# EAGLE design ESP-01_programmer (EAGLE 8.7.0)
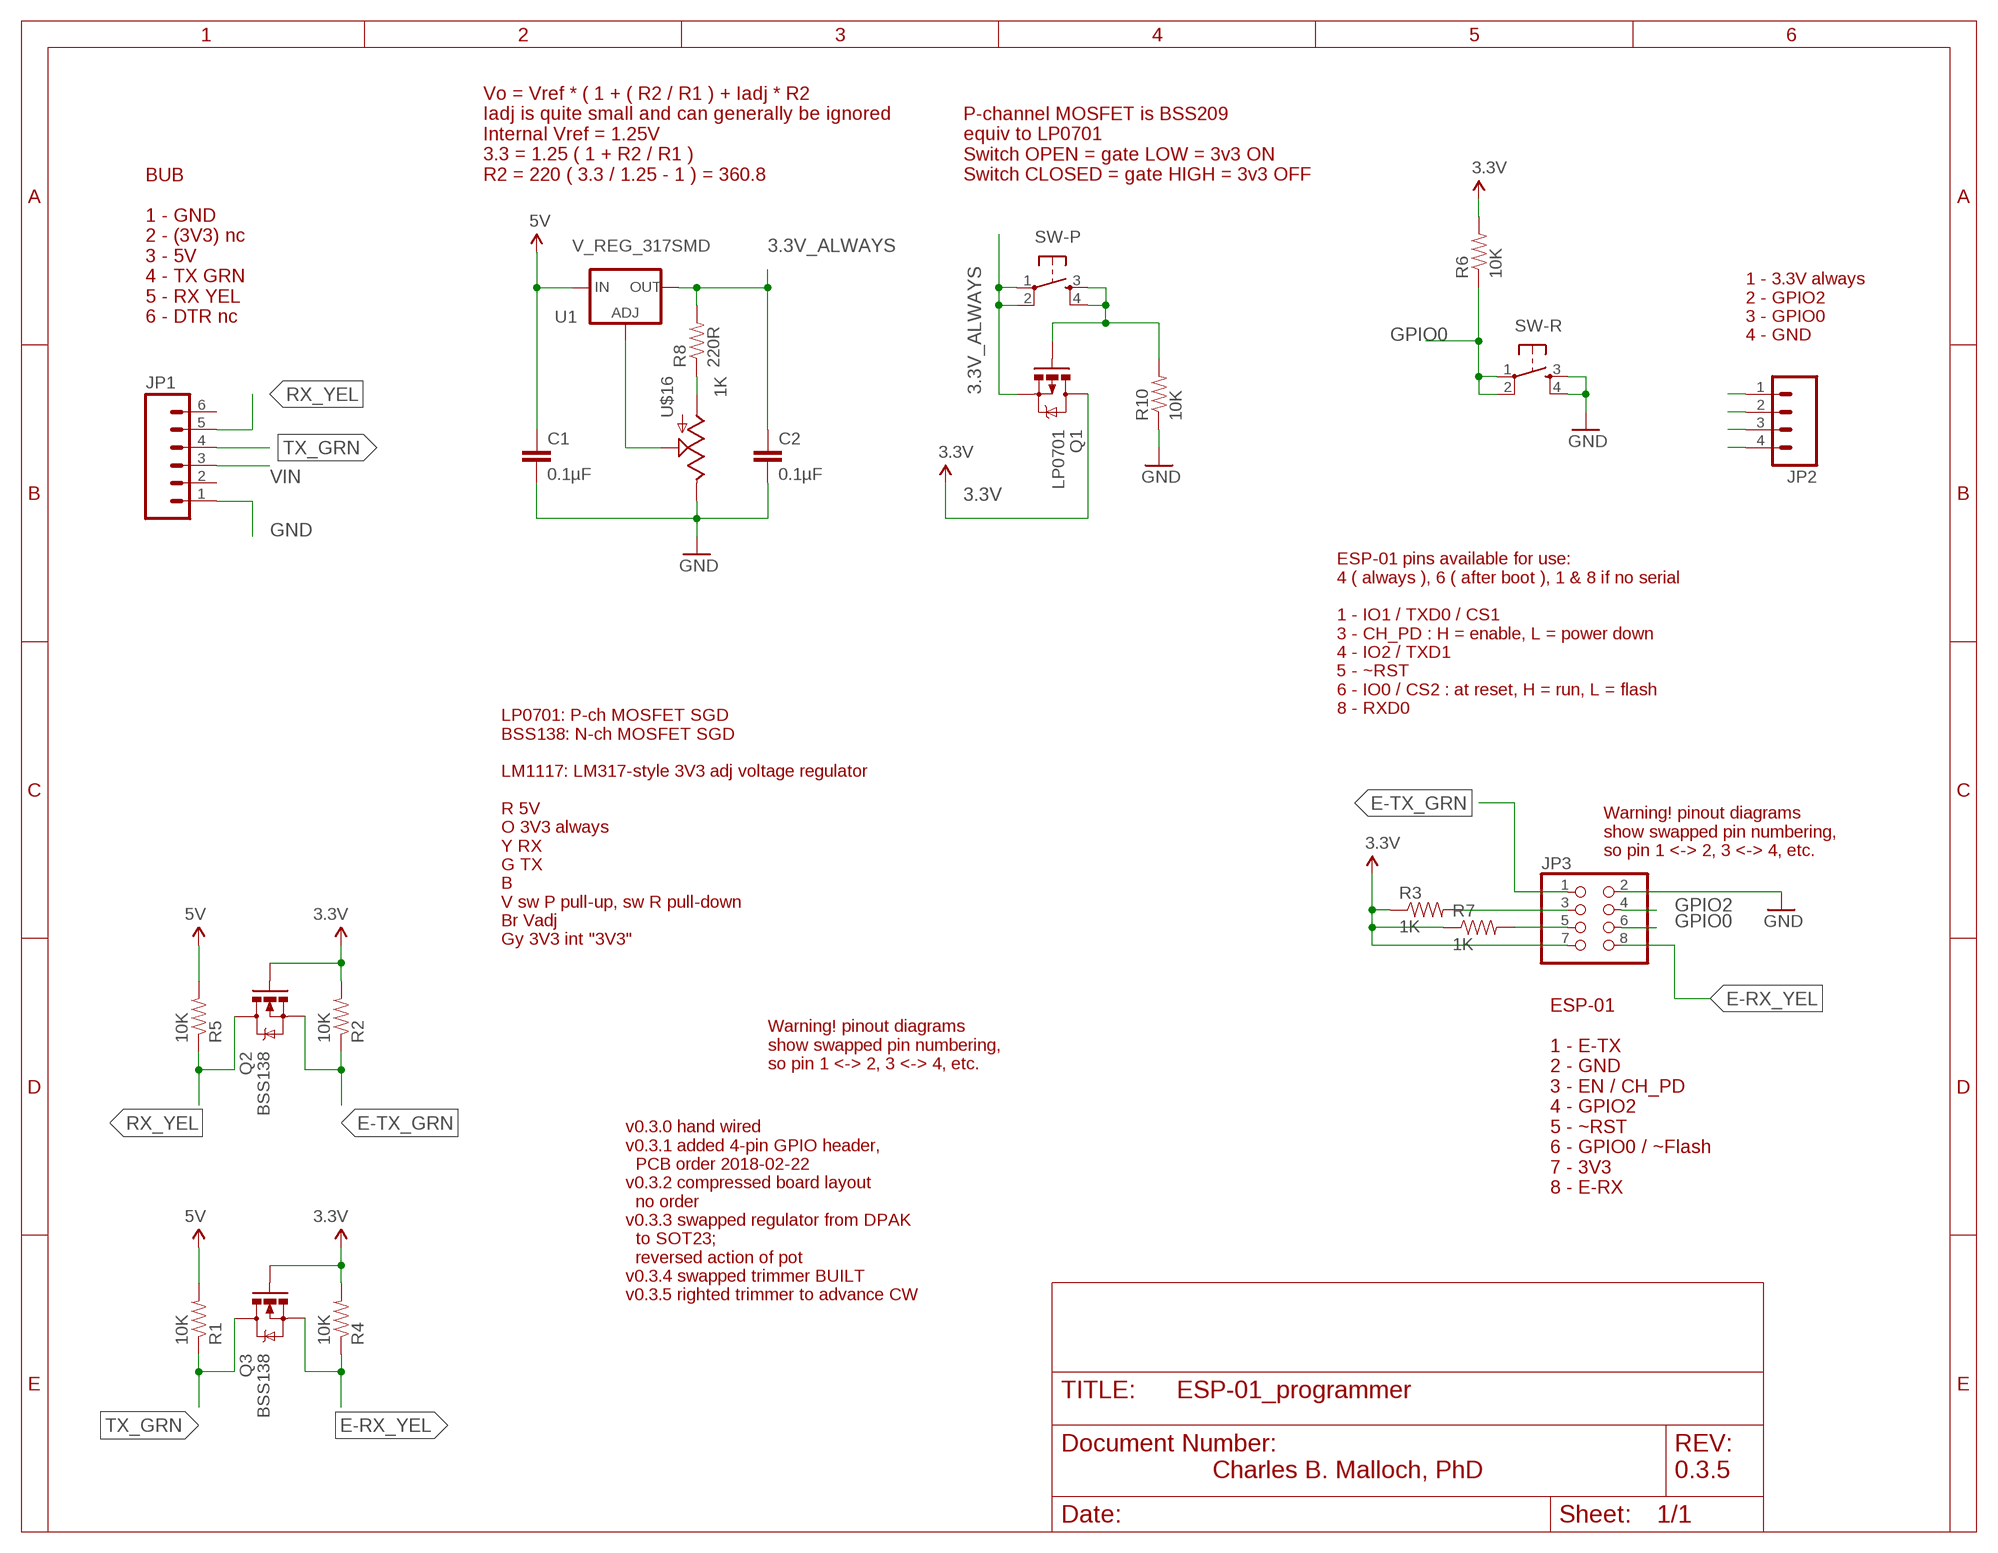
[diagram p0: schematic, sheet 1]

## Parts
C1  0.1µF  CAP1206  [1206]
C2  0.1µF  CAP1206  [1206]
JP1  M06LOCK_LONGPADS  [1X06_LOCK_LONGPADS]
JP2  M04LOCK_LONGPADS  [1X04_LOCK_LONGPADS]
JP3  PINHD-2X4  [2X04]
Q1  LP0701  MOSFET-PCHANNELSMD  [SOT23-3]
Q2  BSS138  BSS138TRANS-00830  [SOT23-3]
Q3  BSS138  BSS138TRANS-00830  [SOT23-3]
R1  10K  RESISTOR1206  [1206]
R2  10K  RESISTOR1206  [1206]
R3  1K  RESISTOR1206  [1206]
R4  10K  RESISTOR1206  [1206]
R5  10K  RESISTOR1206  [1206]
R6  10K  RESISTOR1206  [1206]
R7  1K  RESISTOR1206  [1206]
R8  220R  RESISTOR1206  [1206]
R10  10K  RESISTOR1206  [1206]
SW-P  TAC_SWITCHPTH  [TACTILE-PTH]
SW-R  TAC_SWITCHPTH  [TACTILE-PTH]
U1  V_REG_317SMD  [SOT223]
U$16  1K  POT100K_3362U  [3362U]

## Nets
3.3V: JP3.7 Q1.3(D) Q2.1(G) Q3.1(G) R2.2 R3.1 R4.2 R6.2 R7.1
3.3V_ALWAYS: C2.1 JP2.1 Q1.2(S) R8.2 SW-P.1 SW-P.2 U1.2(OUT)
E-RX_YEL: JP3.8 Q3.2(S) R4.1
E-TX_GRN: JP3.1 Q2.2(S) R2.1
GND: C1.2 C2.2 JP1.1 JP2.4 JP3.2 R10.1 SW-R.3 SW-R.4 U$16.P$1(E)
GPIO0: JP2.3 JP3.6 R6.1 SW-R.1 SW-R.2
GPIO2: JP2.2 JP3.4
N$1: JP3.3 R3.2
N$2: JP3.5 R7.2
N$3: R8.1 U$16.P$3(A)
N$5: U1.1(ADJ) U$16.P$2(S)
N$7: Q1.1(G) R10.2 SW-P.3 SW-P.4
RX_YEL: JP1.5 Q2.3(D) R5.1
TX_GRN: JP1.4 Q3.3(D) R1.1
VIN: C1.1 JP1.3 R1.2 R5.2 U1.3(IN) ; supply symbol labelled 5V
Unconnected: JP1.2 JP1.6

## Notes on the sheet
- Vo = Vref * ( 1 + ( R2 / R1 ) + Iadj * R2
  Iadj is quite small and can generally be ignored
  Internal Vref = 1.25V
  3.3 = 1.25 ( 1 + R2 / R1 )
  R2 = 220 ( 3.3 / 1.25 - 1 ) = 360.8
- P-channel MOSFET is BSS209
  equiv to LP0701
  Switch OPEN = gate LOW = 3v3 ON
  Switch CLOSED = gate HIGH = 3v3 OFF
- BUB
  
  1 - GND
  2 - (3V3) nc
  3 - 5V
  4 - TX GRN
  5 - RX YEL
  6 - DTR nc
- 1 - 3.3V always
  2 - GPIO2
  3 - GPIO0
  4 - GND
- ESP-01 pins available for use:
  4 ( always ), 6 ( after boot ), 1 & 8 if no serial
  
  1 - IO1 / TXD0 / CS1
  3 - CH_PD : H = enable, L = power down
  4 - IO2 / TXD1
  5 - ~RST
  6 - IO0 / CS2 : at reset, H = run, L = flash
  8 - RXD0
- Warning! pinout diagrams 
  show swapped pin numbering, 
  so pin 1 <-> 2, 3 <-> 4, etc.
- LP0701: P-ch MOSFET SGD
  BSS138: N-ch MOSFET SGD
  
  LM1117: LM317-style 3V3 adj voltage regulator
  
  R 5V
  O 3V3 always
  Y RX
  G TX
  B
  V sw P pull-up, sw R pull-down
  Br Vadj
  Gy 3V3 int "3V3"
- Warning! pinout diagrams 
  show swapped pin numbering, 
  so pin 1 <-> 2, 3 <-> 4, etc.
- ESP-01
  
  1 - E-TX
  2 - GND
  3 - EN / CH_PD
  4 - GPIO2
  5 - ~RST
  6 - GPIO0 / ~Flash
  7 - 3V3
  8 - E-RX
- v0.3.0 hand wired
  v0.3.1 added 4-pin GPIO header, 
    PCB order 2018-02-22
  v0.3.2 compressed board layout
    no order
  v0.3.3 swapped regulator from DPAK 
    to SOT23;
    reversed action of pot
  v0.3.4 swapped trimmer BUILT
  v0.3.5 righted trimmer to advance CW
- Charles B. Malloch, PhD | 0.3.5

## Library data of the parts
C1 C2 = SparkFun-Capacitors:CAP: Capacitor Standard 0603 ceramic capacitor, and 0.1" leaded capacitor.
JP1 = SparkFun-Connectors:M06: Header 6 Standard 6-pin 0.1" header. Use with straight break away headers (SKU : PRT-00116), right angle break away headers (PRT-00553), swiss pins (PRT-00743), machine pins (PRT-00117), and female headers (PRT-00115). Molex polarized connector foot print use with SKU : PRT-08094 with associated crimp pins and housings. NOTES ON THE VARIANTS LOCK and LOCK_LONGPADS... This footprint was designed to help hold the alignment of a through-hole component (i.e. 6-pin header) while soldering it into place. You may notice that each hole has been shifted either up or down by 0.005 of an inch from it's more standard position (which is a perfectly straight line). This slight alteration caused the pins (the squares in the middle) to touch the edges of the holes. Because they are alternating, it causes a "brace" to hold the component in place. 0.005 has proven to be the perfect amount of "off-center" position when using our standard breakaway headers. Although looks a little odd when you look at the bare footprint, once you have a header in there, the alteration is very hard to notice. Also, if you push a header all the way into place, it is covered up entirely on the bottom side. This idea of altering the position of holes to aid alignment will be further integrated into the Sparkfun Library for other footprints. It can help hold any component with 3 or more connection pins.
JP2 = SparkFun-Connectors:M04: Header 4 Standard 4-pin 0.1" header. Use with straight break away headers (SKU : PRT-00116), right angle break away headers (PRT-00553), swiss pins (PRT-00743), machine pins (PRT-00117), and female headers (PRT-00115). Molex polarized connector foot print use with SKU : PRT-08231 with associated crimp pins and housings. 1MM SMD Version SKU: PRT-10208
JP3 = pinhead:PINHD-2X4: PIN HEADER
Q1 = SparkFun-DiscreteSemi:MOSFET-PCHANNEL: Generic PMOSFET
Q2 Q3 = SparkFun-DiscreteSemi:BSS138: NMOSFET, Enh Mode 50V/6-ohm 200mA (SOT-23) TRANS-00830; PROD_ID: TRANS-00830
R1-R8 R10 = SparkFun-Passives:RESISTOR: Resistor Basic schematic elements and footprints for 0603, 1206, and PTH resistors.
SW-P SW-R = SparkFun-Electromechanical:TAC_SWITCH: Momentary Switch Button commonly used for reset or general input. Spark Fun Electronics SKU : COM-00097 SMT- SWCH-08247
U1 = SparkFun-PowerIC:V_REG_317: Voltage Regulator Standard LM317 adjustable voltage regulator. AOI (Adjust Output Input). Google 'LM317 Calculator' for easy to use app to get the two resistor values needed. 240/720 for 5V output. 240/390 for 3.3V output. Spark Fun Electronics SKU : COM-00527
U$16 = SparkFun-Electromechanical:POT

## Net classes
0 default: width 0.406 mm, clearance 0.254 mm
1 POWER: width 0.61 mm, clearance 0.305 mm

## Board
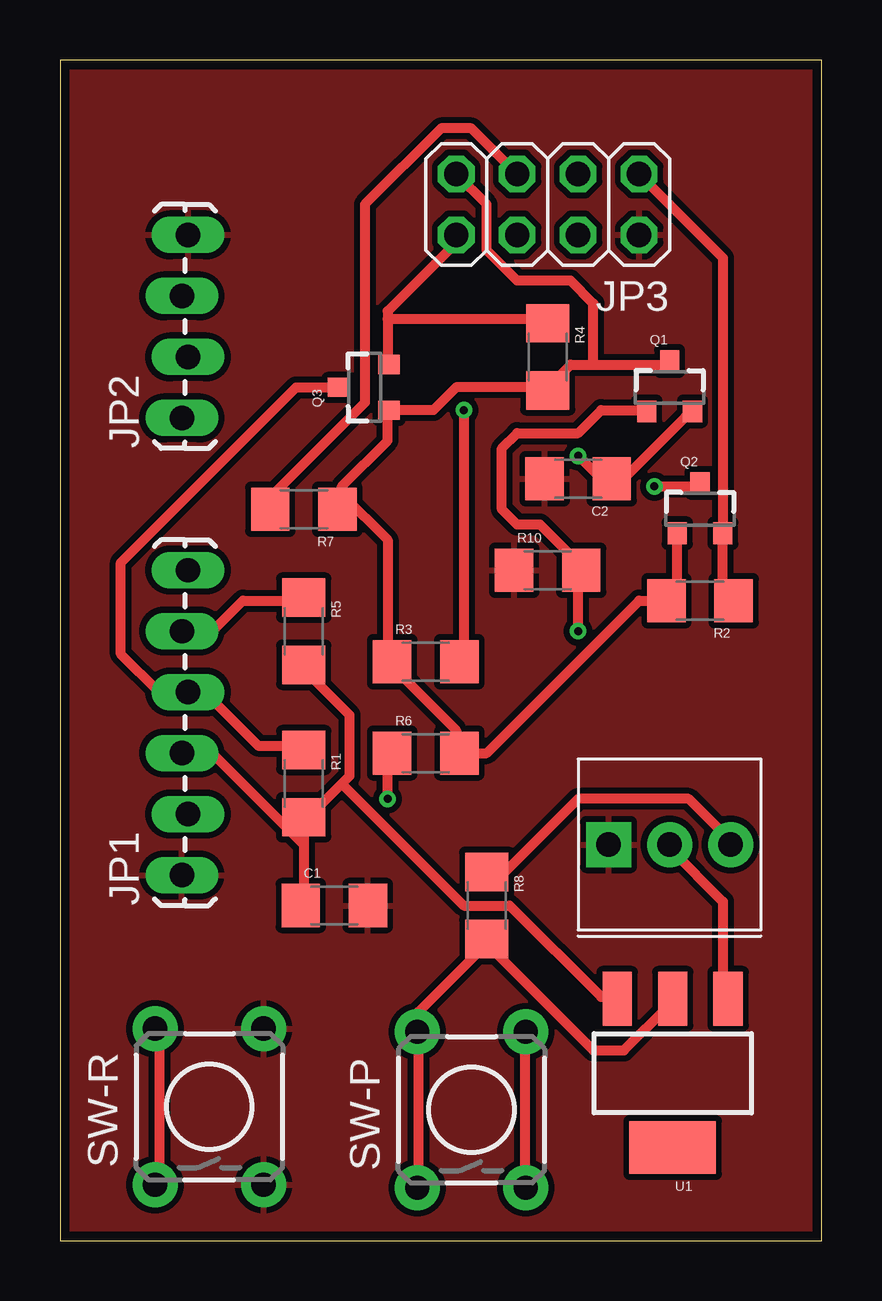
[diagram p1: board, top side]
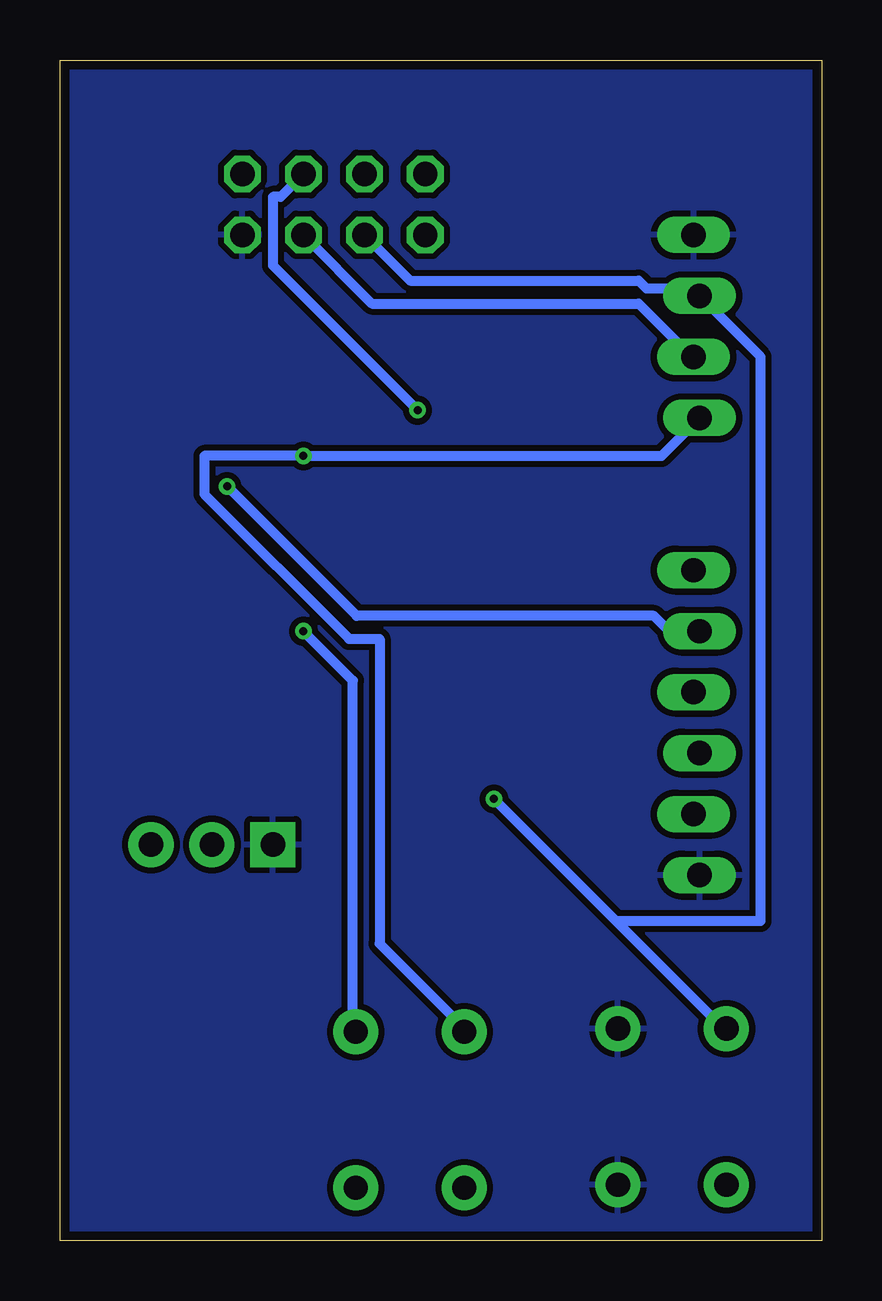
[diagram p2: board, bottom side, seen from below]

Size 31.73 x 49.2 mm. Coordinates in mm from the lower left corner, seen from the top.
Outline: 0,0 31.73,0 31.73,49.2 0,49.2 0,0
Copper layers (1*16): Top 0.0356mm / dielectric 1.5011mm / Bottom 0.0356mm
Design rules "LaenPCBOrder": minimum track width 6mil, minimum drill 13mil, track to track 6mil, track to pad 6mil, pad to pad 6mil, via to via 6mil, smd to smd 6mil, copper to edge 15mil, drill to drill 6mil, minimum pad ring 7mil, minimum via ring 7mil, stop-mask expansion 4mil, vias tented up to drill 0mil, thermal gap 10mil

### Footprints (pad centres in the part's own frame; a part is rotated, then mirrored left to right if it is on the bottom)
1206 = smd 1.6 x 1.8: 1 -1.4,0; 2 1.4,0
1X06_LOCK_LONGPADS = drill 1.016 long: 1 0,0; 2 2.54,-0.254; 3 5.08,0; 4 7.62,-0.254; 5 10.16,0; 6 12.7,-0.254
1X04_LOCK_LONGPADS = drill 1.016 long: 1 0,0; 2 2.54,-0.254; 3 5.08,0; 4 7.62,-0.254
2X04 = drill 1.016 octagon: 1 -3.81,-1.27; 2 -3.81,1.27; 3 -1.27,-1.27; 4 -1.27,1.27; 5 1.27,-1.27; 6 1.27,1.27; 7 3.81,-1.27; 8 3.81,1.27
SOT23-3 = smd 0.8 x 0.9: 1 -0.95,-1; 2 0.95,-1; 3 0,1.1
TACTILE-PTH = drill 1.016 pad 1.88: 1 -3.251,2.261; 2 3.251,2.261; 3 -3.251,-2.261; 4 3.251,-2.261
SOT223 = smd 1.219 x 2.235: 1 -2.311,-3.099; 2 0,-3.099; 3 2.311,-3.099 | smd 3.6 x 2.2: 4 0,3.099
3362U = drill 1.016 pad 1.88 square: P$1 0,2.54 | drill 1.016 pad 1.88: P$2 2.54,2.54; P$3 5.08,2.54

### Placement (x,y rotation side)
C1  11.43,13.97 0 top
C2  21.59,31.75 180 top
JP1  5.08,15.24 90 top
JP2  5.08,34.29 90 top
JP3  20.32,43.18 180 top
Q1  25.4,35.56 0 top
Q2  26.67,30.48 0 top
Q3  12.7,35.56 90 top
R1  10.16,19.05 270 top
R2  26.67,26.67 180 top
R3  15.24,24.13 0 top
R4  20.32,36.83 270 top
R5  10.16,25.4 270 top
R6  15.24,20.32 0 top
R7  10.16,30.48 180 top
R8  17.78,13.97 270 top
R10  20.32,27.94 0 top
SW-P  17.14,5.46 90 top
SW-R  6.22,5.59 90 top
U1  25.53,6.99 180 top
U$16  22.86,13.97 0 top

### Tracks (layer width: path | path; a pad name or v marks a point on that pad's centre or on a via)
3.3V
  Top 0.406: Q2.1 25.72,29.21 25.72,26.99 25.4,26.67 R2.2 24.13,26.67 17.78,20.32 R6.2 16.51,20.32 16.51,21.27 13.65,24.13 | 11.75,31.11 11.75,30.48 R7.1 11.75,31.11 | 11.75,31.11 11.75,31.43 13.65,33.34 13.65,34.61 Q3.1 13.97,34.61 15.56,34.61 16.51,35.56 20.32,35.56 | 22.23,36.51 21.27,36.51 20.32,35.56 | 22.23,36.51 25.4,36.51 Q1.3 | JP3.7 17.78,43.18 17.78,41.27 19.05,40.01 21.27,40.01 22.23,39.05 22.23,36.51 | 20.32,35.56 R4.2 | 13.65,24.13 13.65,29.21 11.75,31.11 | 13.65,24.13 R3.1
3.3V_ALWAYS  (via drill 0.33)
  Top 0.406: 17.78,12.38 14.92,9.53 14.92,8.89 SW-P.2 14.92,8.57 14.92,2.22 SW-P.1 | 17.78,12.38 22.23,7.94 23.5,7.94 25.4,9.84 U1.2 | 17.78,12.38 R8.2 | Q1.2 26.04,34.29 23.5,31.75 C2.1 22.54,31.75 v21.59,32.7
  Bottom 0.406: JP2.1 6.67,32.7 v21.59,32.7 25.72,32.7 25.72,31.11 19.68,25.08 18.41,25.08 18.41,12.38 14.92,8.89 SW-P.2
E-RX_YEL
  Top 0.406: 13.65,38.42 13.65,38.73 16.51,41.59 JP3.8 | 13.65,38.42 13.65,36.51 Q3.2 | 13.65,38.42 20.32,38.42 R4.1
E-TX_GRN
  Top 0.406: R2.1 27.94,26.67 27.62,26.99 27.62,29.21 Q2.2 27.62,29.53 27.62,40.96 JP3.1
GND
  pour Top: 0,49.15 31.75,49.15 31.75,0 0,0
  pour Bottom: 0,49.15 31.75,49.15 31.75,0 0,0
GPIO0  (via drill 0.33)
  Top 0.406: v13.65,18.41 13.65,20.32 R6.1 | SW-R.1 4.13,2.54 4.13,8.57 SW-R.2
  Bottom 0.406: JP3.6 17.14,40.01 7.62,40.01 7.3,39.69 5.4,39.69 JP2.3 2.54,36.83 2.54,13.34 8.57,13.34 | 8.57,13.34 4.13,8.89 SW-R.2 | 8.57,13.34 v13.65,18.41
GPIO2
  Bottom 0.406: JP3.4 18.73,39.05 7.62,39.05 5.4,36.83 JP2.2
N$1  (via drill 0.33)
  Top 0.406: v16.83,34.61 16.83,24.13 R3.2
  Bottom 0.406: v16.83,34.61 22.86,40.64 22.86,43.5 22.54,43.5 JP3.3
N$2
  Top 0.406: JP3.5 17.14,46.35 15.88,46.35 12.7,43.18 12.7,34.92 8.89,31.11 8.89,30.48 R7.2
N$3
  Top 0.406: U$16.P$3 27.94,16.67 26.19,18.41 21.59,18.41 18.57,15.4 17.78,15.4 R8.1
N$5
  Top 0.406: 27.62,10.16 U1.1 27.62,10.32 27.62,14.13 25.4,16.35 U$16.P$2
N$7  (via drill 0.33)
  Top 0.406: Q1.1 24.45,34.61 22.54,34.61 21.59,33.66 19.05,33.66 18.41,33.02 18.41,30.48 19.05,29.84 20,29.84 21.91,27.94 R10.2 21.59,27.94 v21.59,25.4 | SW-P.3 19.37,2.22 19.37,8.57 SW-P.4
  Bottom 0.406: 19.37,8.89 SW-P.4 19.37,9.05 19.53,9.05 19.53,23.34 v21.59,25.4
RX_YEL  (via drill 0.33)
  Top 0.406: v24.77,31.43 26.67,31.43 Q2.3 | JP1.5 6.35,25.4 7.62,26.67 10.16,26.67 R5.1
  Bottom 0.406: v24.77,31.43 19.37,26.04 6.99,26.04 6.35,25.4 JP1.5
TX_GRN
  Top 0.406: Q3.3 9.84,35.56 2.54,28.26 2.54,24.45 4.13,22.86 JP1.4 6.03,22.86 8.26,20.64 10.16,20.64 R1.1
VIN
  Top 0.406: 10.16,17.46 10.16,16.51 | 10.16,16.51 10.16,13.97 C1.1 | 10.16,17.46 11.75,19.05 | 11.75,19.05 12.06,19.37 12.06,21.91 10.16,23.81 R5.2 | 10.16,17.46 R1.2 | 11.75,19.05 16.83,13.97 18.73,13.97 22.54,10.16 23.18,10.16 U1.3 | JP1.3 6.35,20.32 10.16,16.51

### Text on the board
tValues: G 0 2 3v3 | x R T 5v x G
bValues: ESP-01 Programmer v0.3.5 / © cbm Electronics 2018